# EAGLE design auxDaqUnitTop2022 (EAGLE 9.6.2)
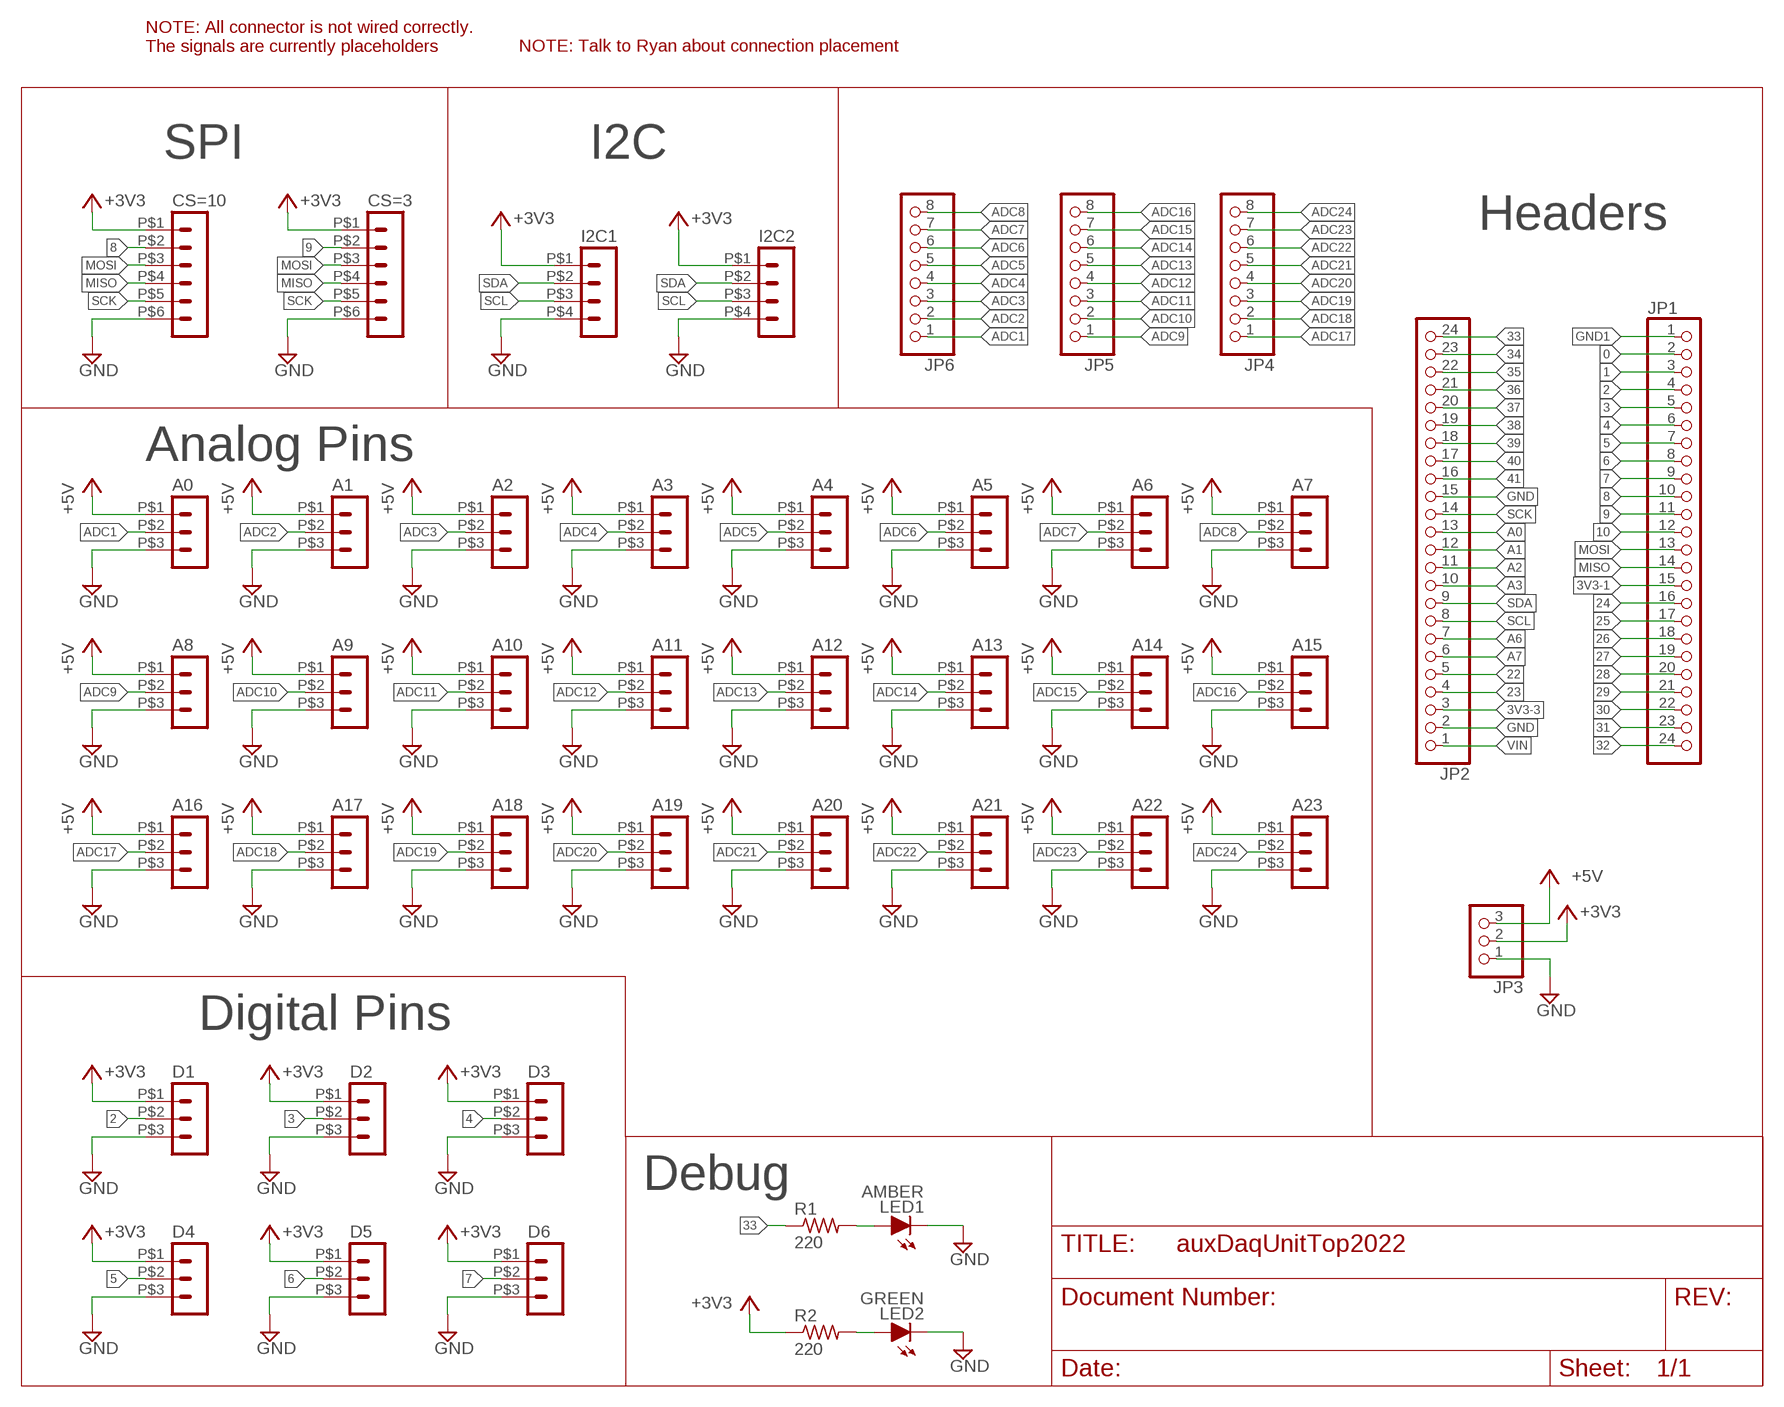
[diagram p0: schematic, sheet 1]
FRAME1 (LETTER_L): NAMEYEAR: PETER2022

## Parts
A0  HEADER_POS3_43650-0300  [43650-0300]
A1  HEADER_POS3_43650-0300  [43650-0300]
A2  HEADER_POS3_43650-0300  [43650-0300]
A3  HEADER_POS3_43650-0300  [43650-0300]
A4  HEADER_POS3_43650-0300  [43650-0300]
A5  HEADER_POS3_43650-0300  [43650-0300]
A6  HEADER_POS3_43650-0300  [43650-0300]
A7  HEADER_POS3_43650-0300  [43650-0300]
A8  HEADER_POS3_43650-0300  [43650-0300]
A9  HEADER_POS3_43650-0300  [43650-0300]
A10  HEADER_POS3_43650-0300  [43650-0300]
A11  HEADER_POS3_43650-0300  [43650-0300]
A12  HEADER_POS3_43650-0300  [43650-0300]
A13  HEADER_POS3_43650-0300  [43650-0300]
A14  HEADER_POS3_43650-0300  [43650-0300]
A15  HEADER_POS3_43650-0300  [43650-0300]
A16  HEADER_POS3_43650-0300  [43650-0300]
A17  HEADER_POS3_43650-0300  [43650-0300]
A18  HEADER_POS3_43650-0300  [43650-0300]
A19  HEADER_POS3_43650-0300  [43650-0300]
A20  HEADER_POS3_43650-0300  [43650-0300]
A21  HEADER_POS3_43650-0300  [43650-0300]
A22  HEADER_POS3_43650-0300  [43650-0300]
A23  HEADER_POS3_43650-0300  [43650-0300]
CS=3  HEADER_POS6_43045-0600  [43045-0600]
CS=10  HEADER_POS6_43045-0600  [43045-0600]
D1  HEADER_POS3_43650-0300  [43650-0300]
D2  HEADER_POS3_43650-0300  [43650-0300]
D3  HEADER_POS3_43650-0300  [43650-0300]
D4  HEADER_POS3_43650-0300  [43650-0300]
D5  HEADER_POS3_43650-0300  [43650-0300]
D6  HEADER_POS3_43650-0300  [43650-0300]
I2C1  HEADER_POS4_43045-0401  [43045-0400]
I2C2  HEADER_POS4_43045-0401  [43045-0400]
JP1  PINHD-1X24  [1X24]
JP2  PINHD-1X24  [1X24]
JP3  PINHD-1X3  [1X03]
JP4  PINHD-1X8  [1X08]
JP5  PINHD-1X8  [1X08]
JP6  PINHD-1X8  [1X08]
LED1  AMBER  LED-0603  [LED-603]
LED2  GREEN  LED-0603  [LED-603]
R1  220  RES_SMDR0603  [R0603]
R2  220  RES_SMDR0603  [R0603]

## Nets
0: JP1.2
1: JP1.3
2: D1.P$2 JP1.4
3: D2.P$2 JP1.5
3V3-1: JP1.15
3V3-3: JP2.3
4: D3.P$2 JP1.6
5: D4.P$2 JP1.7
6: D5.P$2 JP1.8
7: D6.P$2 JP1.9
8: CS=10.P$2 JP1.10
9: CS=3.P$2 JP1.11
10: JP1.12
22: JP2.5
23: JP2.4
24: JP1.16
25: JP1.17
26: JP1.18
27: JP1.19
28: JP1.20
29: JP1.21
30: JP1.22
31: JP1.23
32: JP1.24
33: JP2.24 R1.1
34: JP2.23
35: JP2.22
36: JP2.21
37: JP2.20
38: JP2.19
39: JP2.18
40: JP2.17
41: JP2.16
+3V3: CS=3.P$1 CS=10.P$1 D1.P$1 D2.P$1 D3.P$1 D4.P$1 D5.P$1 D6.P$1 I2C1.P$1 I2C2.P$1 JP3.2 R2.1
+5V: A0.P$1 A1.P$1 A2.P$1 A3.P$1 A4.P$1 A5.P$1 A6.P$1 A7.P$1 A8.P$1 A9.P$1 A10.P$1 A11.P$1 A12.P$1 A13.P$1 A14.P$1 A15.P$1 A16.P$1 A17.P$1 A18.P$1 A19.P$1 A20.P$1 A21.P$1 A22.P$1 A23.P$1 JP3.3
A0: JP2.13
A1: JP2.12
A2: JP2.11
A3: JP2.10
A6: JP2.7
A7: JP2.6
ADC1: A0.P$2 JP6.1
ADC2: A1.P$2 JP6.2
ADC3: A2.P$2 JP6.3
ADC4: A3.P$2 JP6.4
ADC5: A4.P$2 JP6.5
ADC6: A5.P$2 JP6.6
ADC7: A6.P$2 JP6.7
ADC8: A7.P$2 JP6.8
ADC9: A8.P$2 JP5.1
ADC10: A9.P$2 JP5.2
ADC11: A10.P$2 JP5.3
ADC12: A11.P$2 JP5.4
ADC13: A12.P$2 JP5.5
ADC14: A13.P$2 JP5.6
ADC15: A14.P$2 JP5.7
ADC16: A15.P$2 JP5.8
ADC17: A16.P$2 JP4.1
ADC18: A17.P$2 JP4.2
ADC19: A18.P$2 JP4.3
ADC20: A19.P$2 JP4.4
ADC21: A20.P$2 JP4.5
ADC22: A21.P$2 JP4.6
ADC23: A22.P$2 JP4.7
ADC24: A23.P$2 JP4.8
GND: A0.P$3 A1.P$3 A2.P$3 A3.P$3 A4.P$3 A5.P$3 A6.P$3 A7.P$3 A8.P$3 A9.P$3 A10.P$3 A11.P$3 A12.P$3 A13.P$3 A14.P$3 A15.P$3 A16.P$3 A17.P$3 A18.P$3 A19.P$3 A20.P$3 A21.P$3 A22.P$3 A23.P$3 CS=3.P$6 CS=10.P$6 D1.P$3 D2.P$3 D3.P$3 D4.P$3 D5.P$3 D6.P$3 I2C1.P$4 I2C2.P$4 JP2.2 JP2.15 JP3.1 LED1.C LED2.C
GND1: JP1.1
MISO: CS=3.P$4 CS=10.P$4 JP1.14
MOSI: CS=3.P$3 CS=10.P$3 JP1.13
N$1: LED1.A R1.2
N$2: LED2.A R2.2
SCK: CS=3.P$5 CS=10.P$5 JP2.14
SCL: I2C1.P$3 I2C2.P$3 JP2.8
SDA: I2C1.P$2 I2C2.P$2 JP2.9
VIN: JP2.1

## Notes on the sheet
- NOTE: All connector is not wired correctly. 
  The signals are currently placeholders
- NOTE: Talk to Ryan about connection placement
- SPI | I2C
- Headers
- Analog Pins
- Digital Pins
- Debug

## Library data of the parts
A0 A1-A23 D1-D6 = GTOR - Microfit Connector:HEADER_POS3_?: Molex - Micro-Fit 3.0 Series connector, 3.00mm (0.118") pitch header, 3 positions.
CS=3 CS=10 = GTOR - Microfit Connector:HEADER_POS6_?: Molex - Micro-Fit 3.0 Series connector, 3.00mm (0.118") pitch header, 6 positions.
I2C1 I2C2 = GTOR - Microfit Connector:HEADER_POS4_?: Molex - Micro-Fit 3.0 Series connector, 3.00mm (0.118") pitch header, 4 positions.
JP1 JP2 = GTOR - Connectors:PINHD-1X24: PIN HEADER
JP3 = GTOR - Connectors:PINHD-1X3: PIN HEADER
JP4-JP6 = GTOR - Connectors:PINHD-1X8: PIN HEADER
LED1 LED2 = GTOR - Passive Components:LED: Light Emitting Diode (LED) Source: Dangerous Prototypes Eagle Library <https://github.com/DangerousPrototypes/Eagle_Part_Library>
R1 R2 = GTOR - Passive Components:RES_SMD: RESISTOR, American symbol; SPICEPREFIX: R

## Board
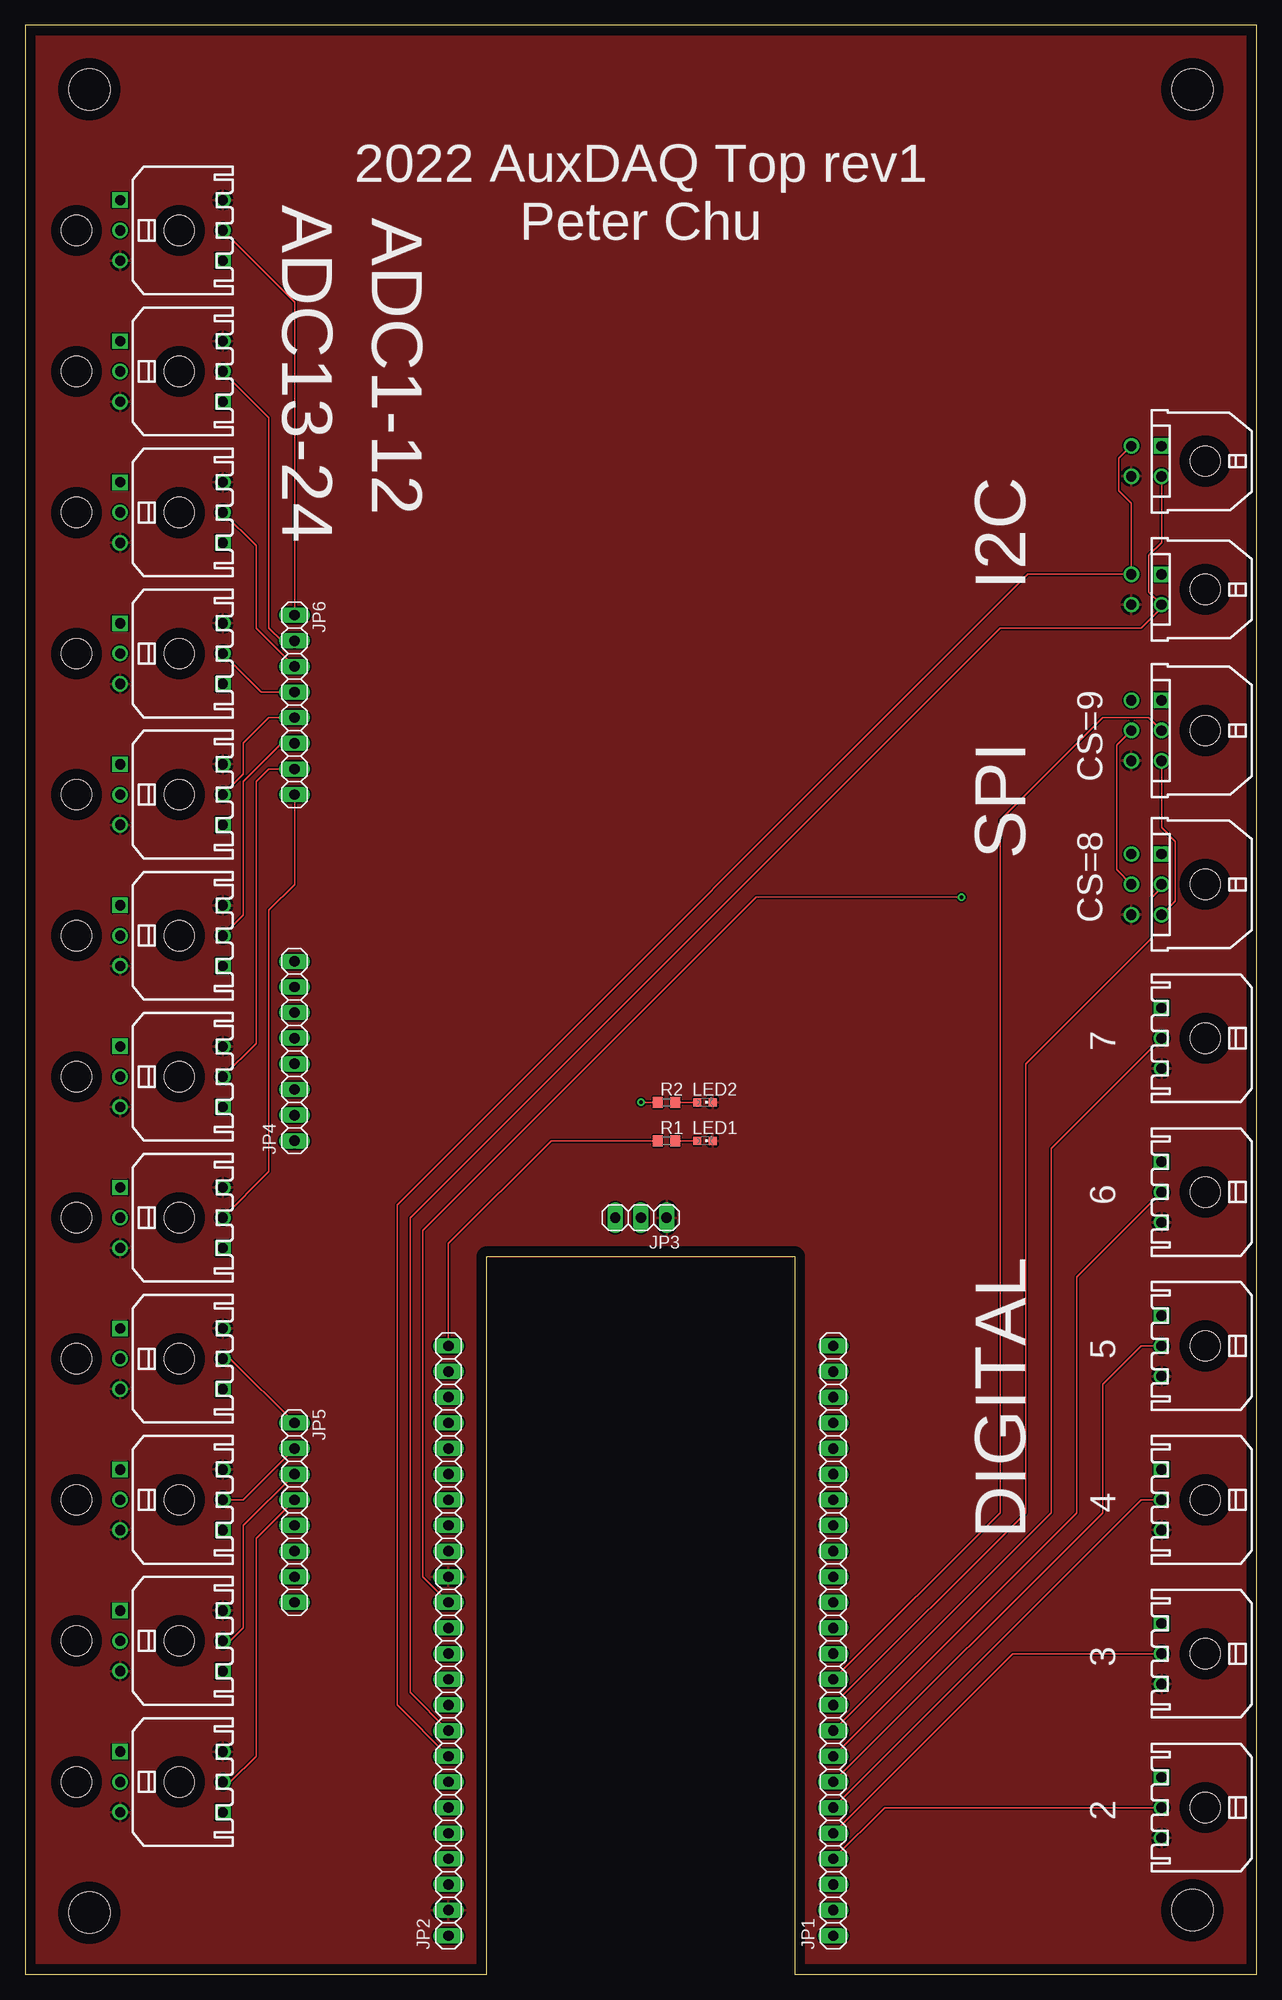
[diagram p1: board, top side]
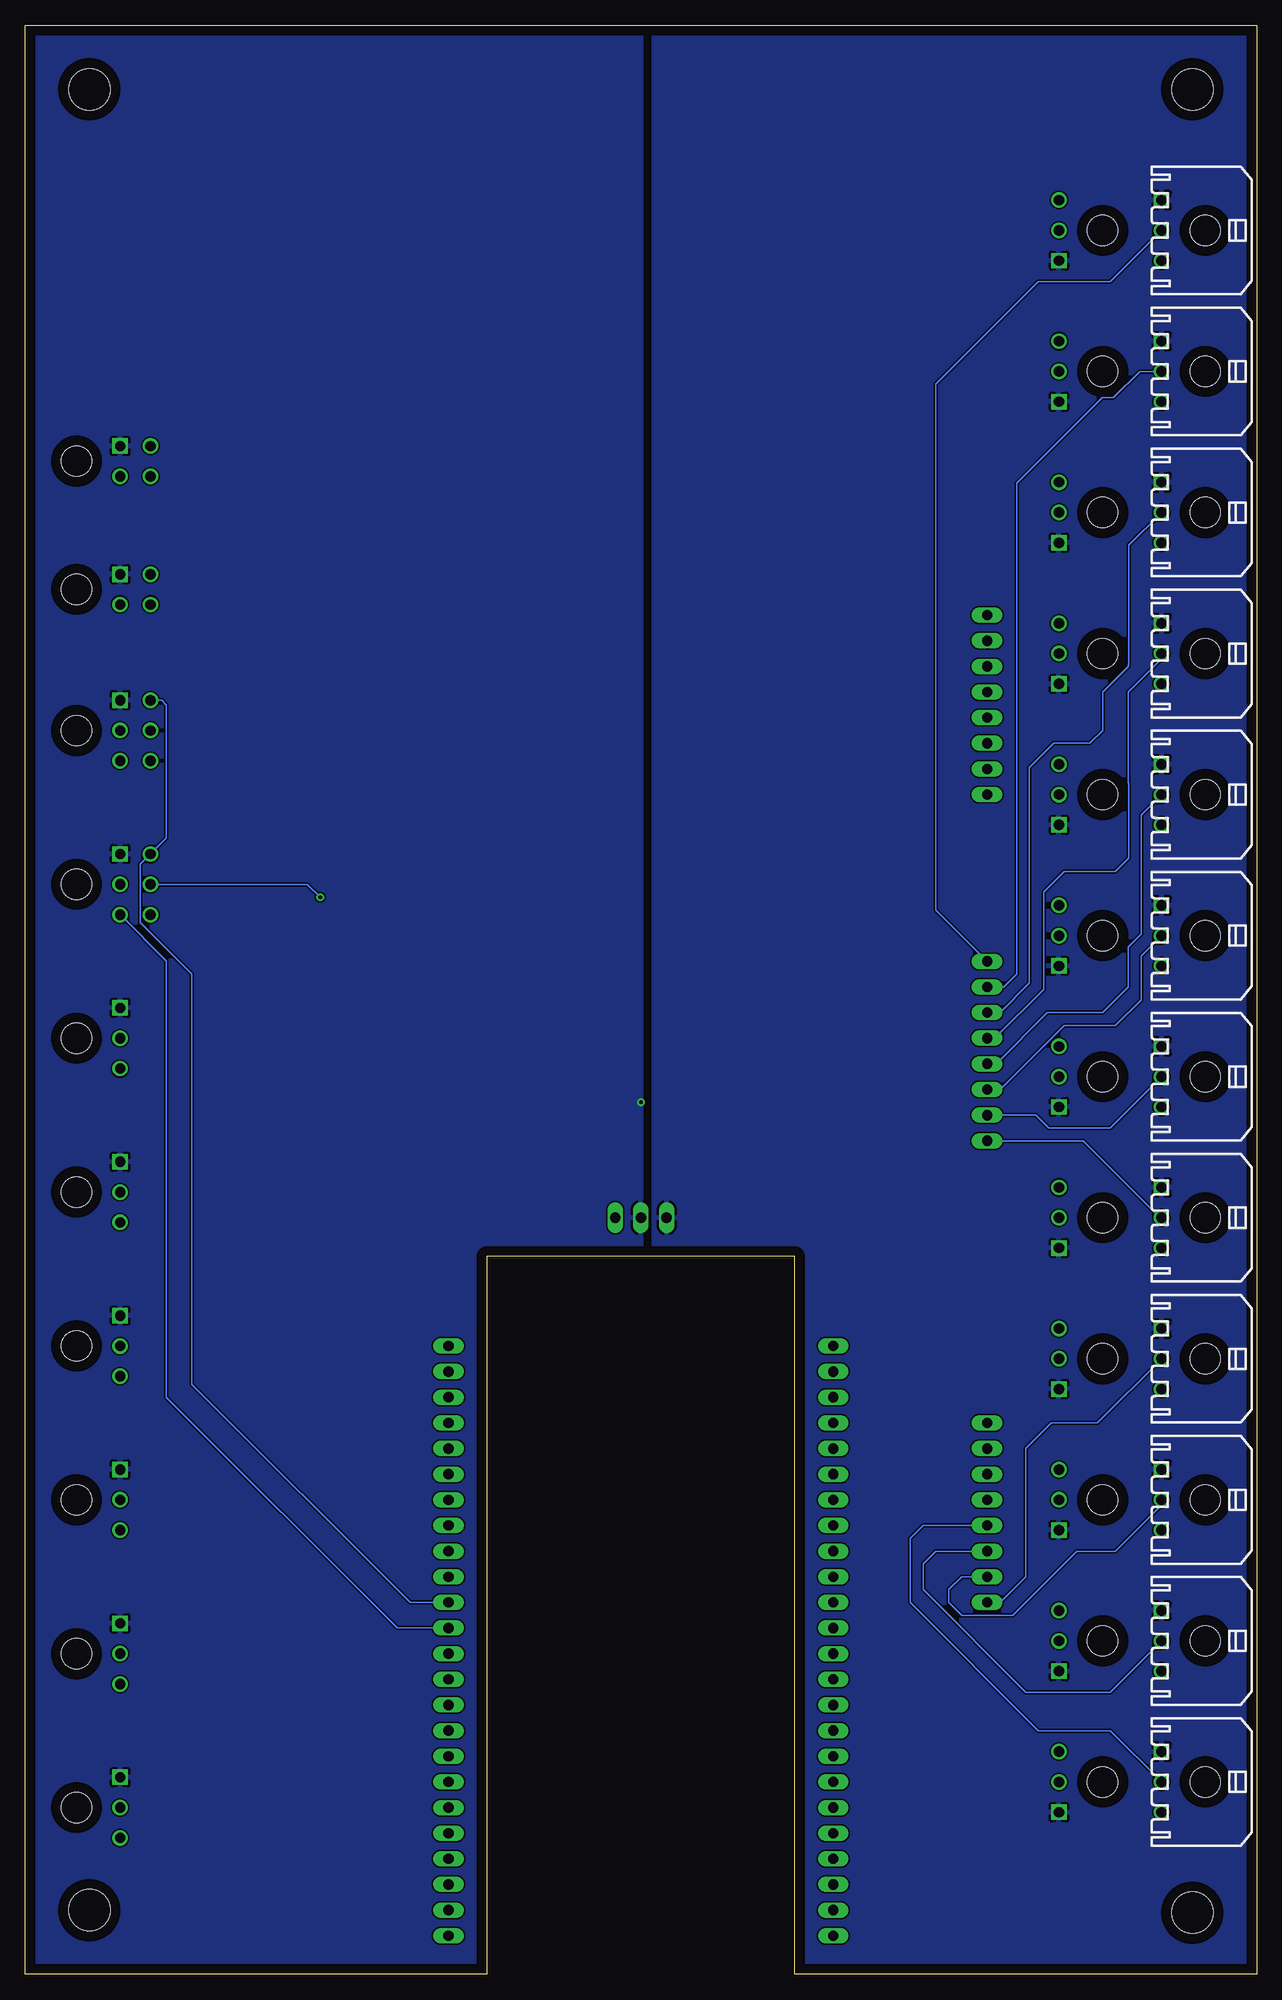
[diagram p2: board, bottom side, seen from below]

Size 121.92 x 193.04 mm. Coordinates in mm from the lower left corner, seen from the top.
Outline: 0,0 45.72,0 45.72,71.12 76.2,71.12 76.2,0 121.92,0 121.92,193.04 0,193.04 0,0
Copper layers (1*16): Top 0.035mm / dielectric 1.5mm / Bottom 0.035mm
Design rules "default": minimum track width 6mil, minimum drill 0.35mm, track to track 6mil, track to pad 6mil, pad to pad 6mil, via to via 6mil, smd to smd 6mil, copper to edge 40mil, drill to drill 6mil, minimum pad ring 10mil, minimum via ring 8mil, stop-mask expansion 4mil, vias tented up to drill 0mil, thermal gap 10mil
Holes 4.1 mm at 6.35,186.69 6.35,6.1 115.57,6.35 115.57,186.69

### Footprints (pad centres in the part's own frame; a part is rotated, then mirrored left to right if it is on the bottom)
43650-0300 = drill 1.02 square: P$1 3,4.32 | drill 1.02: P$2 0,4.32; P$3 -3,4.32 | hole 3: 0,0
43045-0600 = drill 1.02 square: P$1 3,4.32 | drill 1.02: P$2 0,4.32; P$3 -3,4.32; P$4 3,7.32; P$5 0,7.32; P$6 -3,7.32 | hole 3: 0,0
43045-0400 = drill 1.02 square: P$1 1.5,4.32 | drill 1.02: P$2 -1.5,4.32; P$3 1.5,7.32; P$4 -1.5,7.32 | hole 3: 0,0
1X24 = drill 1.016 long: 1 -29.21,0; 2 -26.67,0; 3 -24.13,0; 4 -21.59,0; 5 -19.05,0; 6 -16.51,0; 7 -13.97,0; 8 -11.43,0; 9 -8.89,0; 10 -6.35,0; 11 -3.81,0; 12 -1.27,0; 13 1.27,0; 14 3.81,0; 15 6.35,0; 16 8.89,0; 17 11.43,0; 18 13.97,0; 19 16.51,0; 20 19.05,0; 21 21.59,0; 22 24.13,0; 23 26.67,0; 24 29.21,0
1X03 = drill 1.016 long: 1 -2.54,0; 2 0,0; 3 2.54,0
1X08 = drill 1.016 long: 1 -8.89,0; 2 -6.35,0; 3 -3.81,0; 4 -1.27,0; 5 1.27,0; 6 3.81,0; 7 6.35,0; 8 8.89,0
LED-603 = smd 0.8 x 0.8: A 0,-0.75; C 0,0.75
R0603 = smd 1 x 1.1: 1 -0.85,0; 2 0.85,0

### Placement (x,y rotation side)
A0  15.24,172.72 270 top
A1  15.24,158.75 270 top
A2  15.24,144.78 270 top
A3  15.24,130.81 270 top
A4  15.24,116.84 270 top
A5  15.24,102.87 270 top
A6  15.24,88.9 270 top
A7  15.24,74.93 270 top
A8  15.24,60.96 270 top
A9  15.24,46.99 270 top
A10  15.24,33.02 270 top
A11  15.24,19.05 270 top
A12  5.08,19.05 90 bottom
A13  5.08,33.02 90 bottom
A14  5.08,46.99 90 bottom
A15  5.08,60.96 90 bottom
A16  5.08,74.93 90 bottom
A17  5.08,88.9 90 bottom
A18  5.08,102.87 90 bottom
A19  5.08,116.84 90 bottom
A20  5.08,130.81 90 bottom
A21  5.08,144.78 90 bottom
A22  5.08,158.75 90 bottom
A23  5.08,172.72 90 bottom
CS=3  116.84,123.19 90 top
CS=10  116.84,107.95 90 top
D1  116.84,16.51 90 top
D2  116.84,31.75 90 top
D3  116.84,46.99 90 top
D4  116.84,62.23 90 top
D5  116.84,77.47 90 top
D6  116.84,92.71 90 top
I2C1  116.84,149.86 90 top
I2C2  116.84,137.16 90 top
JP1  80.01,33.02 90 top
JP2  41.91,33.02 90 top
JP3  60.96,74.93 180 top
JP4  26.67,91.44 90 top
JP5  26.67,45.72 270 top
JP6  26.67,125.73 270 top
LED1  67.31,82.55 270 top
LED2  67.31,86.36 270 top
R1  63.5,82.55 0 top
R2  63.5,86.36 0 top

### Tracks (layer width: path | path; a pad name or v marks a point on that pad's centre or on a via)
2
  Top 0.152: JP1.4 85.09,16.51 D1.P$2
3
  Top 0.152: JP1.5 97.79,31.75 D2.P$2
4
  Top 0.152: JP1.6 110.49,46.99 D3.P$2
5
  Top 0.152: JP1.7 106.68,45.72 106.68,58.42 110.49,62.23 D4.P$2
6
  Top 0.152: JP1.8 104.14,45.72 104.14,69.09 D5.P$2
7
  Top 0.152: JP1.9 101.6,45.72 101.6,81.79 D6.P$2
8
  Top 0.152: JP1.10 99.06,45.72 99.06,90.17 111.53,102.64 111.53,106.63 112.52,107.62 CS=10.P$2
9
  Top 0.152: JP1.11 96.52,45.72 96.52,114.3 106.68,124.46 111.25,124.46 CS=3.P$2
33
  Top 0.152: JP2.24 41.91,72.39 52.07,82.55 R1.1
+3V3  (via drill 0.35)
  Top 0.152: R2.1 v60.96,86.36
  pour Bottom: 60.96,228.6 60.96,-11.43 132.08,-11.43 135.89,-7.62 135.89,229.87 137.16,231.14 60.96,231.14
+5V
  pour Bottom: 59.69,229.87 59.69,-10.16 -7.62,-10.16 -7.62,232.41 -5.08,234.95 54.61,234.95
ADC1
  Top 0.152: A0.P$2 26.67,165.61 JP6.1
ADC2
  Top 0.152: A1.P$2 24.13,154.18 24.13,133.35 25.4,132.08 JP6.2
ADC3
  Top 0.152: A2.P$2 22.86,141.48 22.86,133.35 JP6.3
ADC4
  Top 0.152: A3.P$2 23.37,127 JP6.4
ADC5
  Top 0.152: A4.P$2 21.59,118.87 21.59,121.92 24.13,124.46 JP6.5
ADC6
  Top 0.152: A5.P$2 21.59,104.9 21.59,118.11 25.4,121.92 JP6.6
ADC7
  Top 0.152: JP6.7 24.13,119.38 22.86,118.11 22.86,92.2 A6.P$2
ADC8
  Top 0.152: JP6.8 26.67,107.95 24.13,105.41 24.13,79.5 A7.P$2
ADC9
  Top 0.152: JP5.1 20.32,60.96 A8.P$2
ADC10
  Top 0.152: JP5.2 21.59,46.99 A9.P$2
ADC11
  Top 0.152: A10.P$2 20.32,33.02 21.59,34.29 21.59,44.45 JP5.3
ADC12
  Top 0.152: JP5.4 22.86,43.18 22.86,21.59 20.32,19.05 A11.P$2
ADC13
  Bottom 0.152: JP5.5 33.02,44.45 34.29,43.18 34.29,36.83 21.59,24.13 14.48,24.13 A12.P$2
ADC14
  Bottom 0.152: JP5.6 31.75,41.91 33.02,40.64 33.02,38.1 22.86,27.94 14.48,27.94 A13.P$2
ADC15
  Bottom 0.152: JP5.7 29.21,39.37 30.48,38.1 30.48,36.83 29.21,35.56 24.13,35.56 17.78,41.91 13.97,41.91 9.4,46.48 A14.P$2
ADC16
  Bottom 0.152: A15.P$2 15.75,54.61 20.32,54.61 22.86,52.07 22.86,39.37 25.4,36.83 JP5.8
ADC17
  Bottom 0.152: A16.P$2 9.53,74.93 17.14,82.55 JP4.1
ADC18
  Bottom 0.152: A17.P$2 14.48,83.82 20.57,83.82 21.84,85.09 JP4.2
ADC19
  Bottom 0.152: A18.P$2 11.43,100.84 11.43,96.52 13.97,93.98 19.05,93.98 25.4,87.63 JP4.3
ADC20
  Bottom 0.152: A19.P$2 11.43,114.81 11.43,103.01 12.7,101.74 12.7,97.79 15.24,95.25 20.7,95.25 25.78,90.17 JP4.4
ADC21
  Bottom 0.152: JP4.5 25.91,92.71 21.08,97.54 21.08,107.19 19.05,109.22 13.97,109.22 12.65,110.54 12.65,117.91 12.7,117.97 12.7,127 9.4,130.3 A20.P$2
ADC22
  Bottom 0.152: JP4.6 25.4,95.25 22.48,98.17 22.48,119.51 20.07,121.92 16.51,121.92 15.24,123.19 15.24,127 12.7,129.54 12.7,129.68 12.65,129.74 12.65,141.53 A21.P$2
ADC23
  Bottom 0.152: JP4.7 25.02,97.79 23.75,99.06 23.75,147.7 15.29,156.16 14.17,156.16 11.57,158.75 A22.P$2
ADC24
  Bottom 0.152: JP4.8 31.75,105.41 31.75,157.48 21.59,167.64 14.48,167.64 A23.P$2
GND
  pour Top: -3.81,187.96 -3.81,-7.62 -1.27,-10.16 118.11,-10.16 135.89,7.62 146.05,17.78 146.05,199.39 -1.27,199.39 -3.81,196.85
MISO
  Bottom 0.152: JP1.14 83.82,36.83 105.41,58.42 105.41,99.06 110.51,104.16 110.51,109.96 CS=10.P$4 107.95,112.52 107.95,125.73 108.41,126.19 CS=3.P$4
MOSI
  Top 0.152: CS=3.P$3 112.52,113.56 113.89,112.19 113.89,106.28 112.56,104.95 CS=10.P$3
  Bottom 0.152: JP1.13 85.09,34.29 107.95,57.15 107.95,100.38 CS=10.P$3
N$1
  Top 0.152: R1.2 LED1.A
N$2
  Top 0.152: R2.2 LED2.A
SCK  (via drill 0.35)
  Top 0.152: v92.71,106.68 72.39,106.68 39.37,73.66 39.37,39.37 JP2.14 | CS=3.P$5 108.08,121.75 108.08,109.39 CS=10.P$5
  Bottom 0.152: v92.71,106.68 93.98,107.95 CS=10.P$5
SCL
  Top 0.152: JP2.8 36.83,26.67 36.83,76.2 99.29,138.66 I2C2.P$3 109.52,145.69 108.27,146.93 108.27,150.17 109.46,151.36 I2C1.P$3
SDA
  Top 0.152: JP2.9 38.1,27.94 38.1,74.93 96.52,133.35 110.49,133.35 112.52,135.38 I2C2.P$2 111.27,136.91 111.27,140.54 112.52,141.78 I2C1.P$2

### Text on the board
tNames: 2022 AuxDAQ Top rev1 / Peter Chu | ADC13-24 | ADC1-12 | I2C | CS=9 | SPI | CS=8 | 7 | 6 | 5 | 4 | DIGITAL | 3 | 2
tDocu: 3.3v | Debug / Pin 30